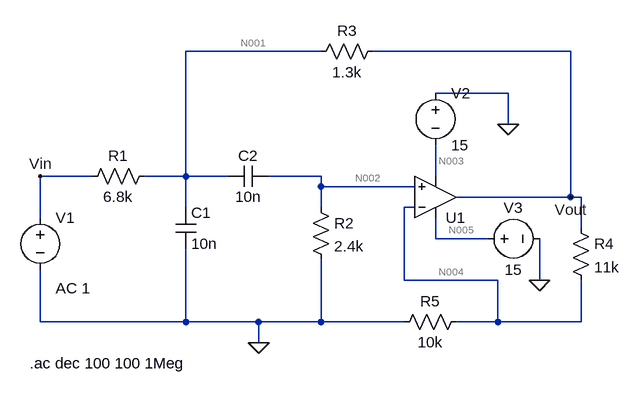
[diagram p0: schematic SallenKey_Bandpass.asc]
SallenKey_Bandpass.asc, the LTspice schematic file:
Version 4.1
SHEET 1 996 680
WIRE 528 -64 320 -64
WIRE 912 -64 608 -64
WIRE 816 0 704 0
WIRE 816 48 816 0
WIRE 176 128 96 128
WIRE 320 128 320 -64
WIRE 320 128 256 128
WIRE 384 128 320 128
WIRE 528 128 448 128
WIRE 704 128 704 80
WIRE 528 144 528 128
WIRE 672 144 528 144
WIRE 912 160 912 -64
WIRE 912 160 736 160
WIRE 928 160 912 160
WIRE 320 176 320 128
WIRE 528 176 528 144
WIRE 672 176 656 176
WIRE 96 192 96 128
WIRE 928 208 928 160
WIRE 704 224 704 192
WIRE 784 224 704 224
WIRE 656 288 656 176
WIRE 800 288 656 288
WIRE 864 288 864 224
WIRE 96 352 96 272
WIRE 320 352 320 240
WIRE 320 352 96 352
WIRE 432 352 320 352
WIRE 528 352 528 256
WIRE 528 352 432 352
WIRE 656 352 528 352
WIRE 800 352 800 288
WIRE 800 352 736 352
WIRE 928 352 928 288
WIRE 928 352 800 352
WIRE 432 384 432 352
FLAG 864 288 0
FLAG 816 48 0
FLAG 432 384 0
FLAG 912 160 Vout
FLAG 96 128 Vin
SYMBOL OpAmps\\UniversalOpAmp 704 160 M180
SYMATTR InstName U1
SYMBOL res 272 112 R90
WINDOW 0 0 56 VBottom 2
WINDOW 3 32 56 VTop 2
SYMATTR InstName R1
SYMATTR Value 6.8k
SYMBOL cap 304 176 R0
SYMATTR InstName C1
SYMATTR Value 10n
SYMBOL cap 448 112 R90
WINDOW 0 0 32 VBottom 2
WINDOW 3 32 32 VTop 2
SYMATTR InstName C2
SYMATTR Value 10n
SYMBOL res 512 160 R0
SYMATTR InstName R2
SYMATTR Value 2.4k
SYMBOL res 624 -80 R90
WINDOW 0 0 56 VBottom 2
WINDOW 3 32 56 VTop 2
SYMATTR InstName R3
SYMATTR Value 1.3k
SYMBOL res 912 192 R0
SYMATTR InstName R4
SYMATTR Value 11k
SYMBOL res 752 336 R90
WINDOW 0 0 56 VBottom 2
WINDOW 3 32 56 VTop 2
SYMATTR InstName R5
SYMATTR Value 10k
SYMBOL voltage 704 -16 R0
WINDOW 123 0 0 Left 0
WINDOW 39 0 0 Left 0
SYMATTR InstName V2
SYMATTR Value 15
SYMBOL voltage 768 224 R270
WINDOW 0 32 56 VTop 2
WINDOW 3 -32 56 VBottom 2
WINDOW 123 0 0 Left 0
WINDOW 39 0 0 Left 0
SYMATTR InstName V3
SYMATTR Value 15
SYMBOL voltage 96 176 R0
WINDOW 123 24 124 Left 2
WINDOW 39 0 0 Left 0
SYMATTR InstName V1
SYMATTR Value ""
SYMATTR Value2 AC 1
TEXT 80 416 Left 2 !.ac dec 100 100 1Meg

The netlist it stands for:
* SallenKey_Bandpass.asc
X§U1 N002 N004 N005 N003 Vout level1 Avol=1Meg GBW=10Meg Vos=0 En=0 Enk=0 In=0 Ink=0 Rin=500Meg  ; pins In+ In- V+ V- OUT
R1 N001 Vin 6.8k
C1 N001 0 10n
C2 N002 N001 10n
R2 N002 0 2.4k
R3 Vout N001 1.3k
R4 Vout N004 11k
R5 N004 0 10k
V2 0 N003 15
V3 N005 0 15
V1 Vin 0 AC 1
.ac dec 100 100 1Meg
.lib UniversalOpAmp1.lib
.backanno
.end

* Results of the author's LTspice run, read from the files saved beside the schematic
* Operating Point, zero values left out:
*   V(n003) = -15 V
*   V(n005) = 15 V
*   I(V2) = -30 nA
*   I(V3) = -30 nA
*   Ix(u1:3) = 30 nA
*   Ix(u1:4) = -30 nA
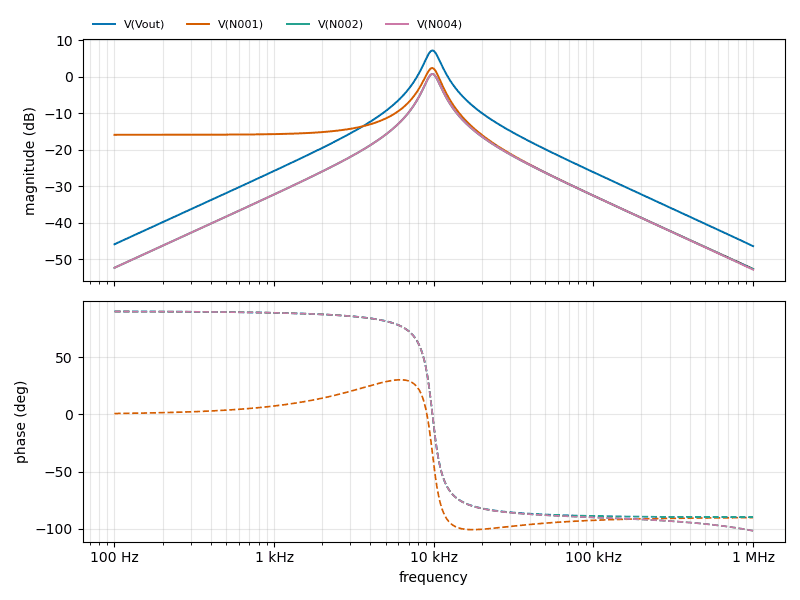
[diagram p1: AC Analysis of SallenKey_Bandpass.asc, plotted from the saved traces]
* AC Analysis, 1 run:
*   V(Vout): -45.88 dB at 100 Hz, -46.40 dB at 1 MHz, peak 7.23 dB at 9.772 kHz, 3 dB below the peak at 8.802 kHz and 10.93 kHz
*   V(N001): -15.89 dB at 100 Hz, -52.66 dB at 1 MHz, peak 2.43 dB at 9.772 kHz, 3 dB below the peak at 8.729 kHz and 10.86 kHz
*   V(N002): -52.32 dB at 100 Hz, -52.66 dB at 1 MHz, peak 0.79 dB at 9.772 kHz, 3 dB below the peak at 8.802 kHz and 10.93 kHz
*   V(N004): -52.32 dB at 100 Hz, -52.85 dB at 1 MHz, peak 0.79 dB at 9.772 kHz, 3 dB below the peak at 8.802 kHz and 10.93 kHz